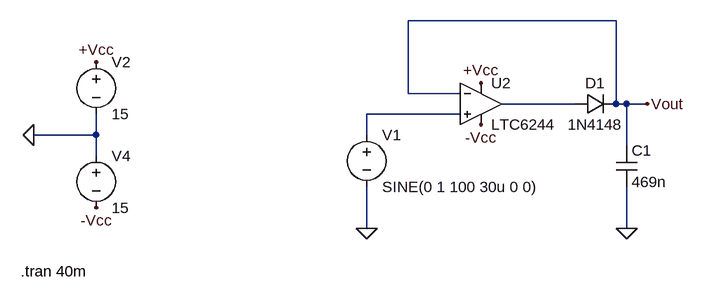
[diagram p0: schematic peakDetector.asc]
peakDetector.asc, the LTspice schematic file:
Version 4
SHEET 1 880 680
WIRE 384 16 64 16
WIRE 64 128 64 16
WIRE 144 128 64 128
WIRE 320 144 208 144
WIRE 384 144 384 16
WIRE 400 144 384 144
WIRE 432 144 400 144
WIRE 144 160 0 160
WIRE -416 192 -416 160
WIRE -416 192 -512 192
WIRE 0 192 0 160
WIRE 400 208 400 144
WIRE -416 224 -416 192
WIRE 0 336 0 272
WIRE 400 336 400 272
FLAG 176 112 +Vcc
FLAG 176 176 -Vcc
FLAG 0 336 0
FLAG -512 192 0
FLAG -416 80 +Vcc
FLAG -416 304 -Vcc
FLAG 432 144 Vout
FLAG 400 336 0
SYMBOL diode 320 160 R270
WINDOW 0 32 32 VTop 2
WINDOW 3 0 32 VBottom 2
SYMATTR InstName D1
SYMATTR Value 1N4148
SYMBOL voltage 0 176 R0
WINDOW 123 0 0 Left 0
WINDOW 39 0 0 Left 0
SYMATTR InstName V1
SYMATTR Value SINE(0 1 100 30u 0 0)
SYMBOL voltage -416 64 R0
WINDOW 123 0 0 Left 0
WINDOW 39 0 0 Left 0
SYMATTR InstName V2
SYMATTR Value 15
SYMBOL voltage -416 208 R0
WINDOW 123 0 0 Left 0
WINDOW 39 0 0 Left 0
SYMATTR InstName V4
SYMATTR Value 15
SYMBOL OpAmps\\LTC6244 176 144 R0
SYMATTR InstName U2
SYMBOL cap 384 208 R0
SYMATTR InstName C1
SYMATTR Value 469n
TEXT -532 402 Left 2 !.tran 40m

The netlist it stands for:
* peakDetector.asc
D1 N001 Vout 1N4148
V1 N002 0 SINE(0 1 100 30u 0 0)
V2 +Vcc 0 15
V4 0 -Vcc 15
XU2 N002 Vout +Vcc -Vcc N001 LTC6244  ; pins In+ In- V+ V- OUT
C1 Vout 0 469n
.model D D
.lib standard.dio
.tran 40m
.backanno
.end